# Altium schematic sheet Arduino nano.SchDoc
size A4
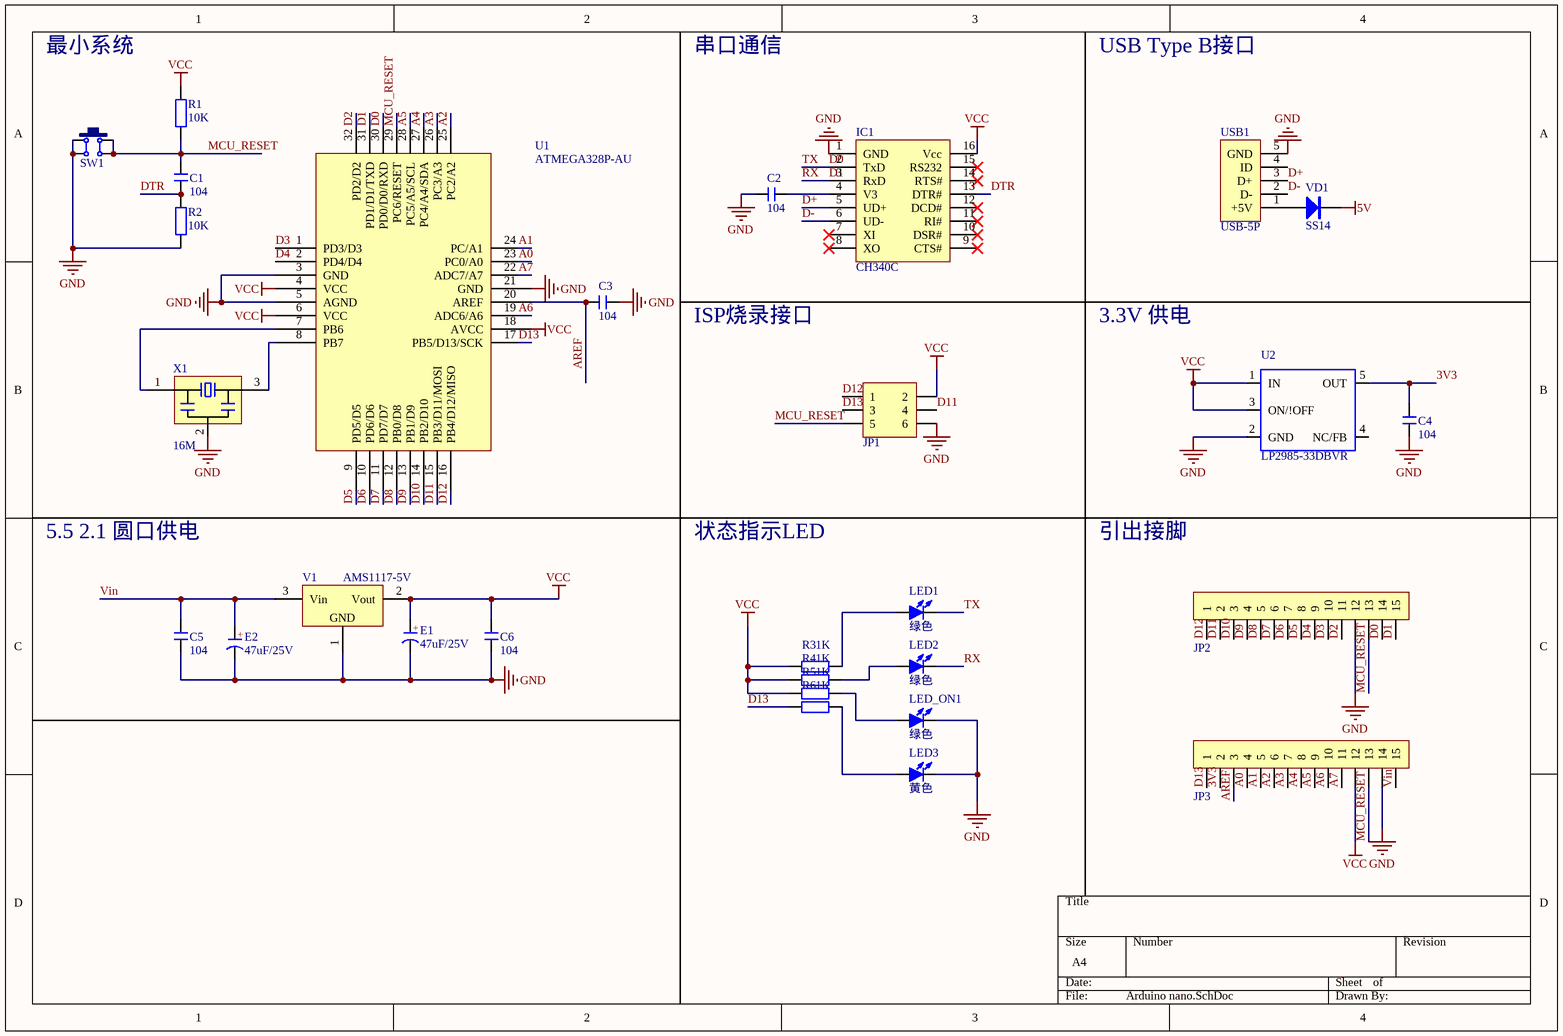
[diagram p0: Arduino nano.SchDoc]

## Parts
C1  104  [C 0603_L]
C2  104  [C 0603_L]
C3  104  [C 0603_L]
C4  104  [C 0603_L]
C5  104  [C 0603_L]
C6  104  [C 0603_L]
E1  47uF/25V  [CD A(3216)]
E2  47uF/25V  [CD A(3216)]
IC1  CH340C  [SOP16_L]
JP1  Header3X2  [HDR2.54-LI-2x3P]  (value not drawn)
JP2  HDR-1X15  [HDR2.54-LI-15P]  (value not drawn)
JP3  HDR-1X15  [HDR2.54-LI-15P]  (value not drawn)
LED1  绿色  [LED 0603B]
LED2  绿色  [LED 0603B]
LED3  黄色  [LED 0603B]
LED_ON1  绿色  [LED 0603B]
R1  10K  [R 0603_L]
R2  10K  [R 0603_L]
R3  1K  [R 0603_L]
R4  1K  [R 0603_L]
R5  1K  [R 0603_L]
R6  1K  [R 0603_L]
SW1  4x4x1.5  [TS4x4x1.5]  (value not drawn)
U1  ATMEGA328P-AU  [LQFP32 7X7_L]
U2  LP2985-33DBVR  [SOT23-5L]
USB1  USB-5P  [USB-MICRO_A]
V1  AMS1117-5V  [SOT223_N]
VD1  SS14  [SMA]
X1  16M  [OSC-3.2-1.3-3P]

## Nets
5V: VD1.2(K)
GND: C2.1 C3.2 C4.1 C5.1 C6.1 E1.2(K) E2.2(K) IC1.1(GND) JP1.6 JP2.12 JP3.14 LED3.2(K) LED_ON1.2(K) R2.1 SW1.1 SW1.4 U1.3(GND) U1.5(AGND) U1.21(GND) U2.2(GND) USB1.5(GND) V1.1(GND) X1.2
VCC: C6.2 E1.1(A) IC1.16(Vcc) JP1.2 JP3.12 R1.1 R3.2 R4.2 R5.2 U1.4(VCC) U1.6(VCC) U1.18(AVCC) U2.1(IN) U2.3(ON/!OFF) V1.2(Vout)
3V3: C4.2 JP3.2 U2.5(OUT)
A0: JP3.4 U1.23(PC0/A0)
A1: JP3.5 U1.24(PC/A1)
A2: JP3.6 U1.25(PC2/A2)
A3: JP3.7 U1.26(PC3/A3)
A4: JP3.8 U1.27(PC4/A4/SDA)
A5: JP3.9 U1.28(PC5/A5/SCL)
A6: JP3.10 U1.19(ADC6/A6)
A7: JP3.11 U1.22(ADC7/A7)
AREF: C3.1 JP3.3 U1.20(AREF)
D0: IC1.2(TxD) JP2.14 LED1.2(K) U1.30(PD0/D0/RXD)  [also labelled TX]
D1: IC1.3(RxD) JP2.15 LED2.2(K) U1.31(PD1/D1/TXD)  [also labelled RX]
D2: JP2.11 U1.32(PD2/D2)
D3: JP2.10 U1.1(PD3/D3)
D4: JP2.9 U1.2(PD4/D4)
D5: JP2.8 U1.9(PD5/D5)
D6: JP2.7 U1.10(PD6/D6)
D7: JP2.6 U1.11(PD7/D7)
D8: JP2.5 U1.12(PB0/D8)
D9: JP2.4 U1.13(PB1/D9)
D10: JP2.3 U1.14(PB2/D10)
D11: JP1.4 JP2.2 U1.15(PB3/D11/MOSI)
D12: JP1.1 JP2.1 U1.16(PB4/D12/MISO)
D13: JP1.3 JP3.1 R6.2 U1.17(PB5/D13/SCK)
D+: IC1.5(UD+) USB1.3(D+)
D-: IC1.6(UD-) USB1.2(D-)
DTR: C1.1 IC1.13(DTR#) R2.2
MCU_RESET: C1.2 JP1.5 JP2.13 JP3.13 R1.2 SW1.2 SW1.3 U1.29(PC6/RESET)
Vin: C5.2 E2.1(A) JP3.15 V1.3(Vin)
NetC2_2: C2.2 IC1.4(V3)
NetLED1_1: LED1.1(A) R3.1
NetLED2_1: LED2.1(A) R4.1
NetLED3_1: LED3.1(A) R6.1
NetLED_ON1_1: LED_ON1.1(A) R5.1
NetU1_7: U1.7(PB6) X1.1
NetU1_8: U1.8(PB7) X1.3
NetUSB1_1: USB1.1(+5V) VD1.1(A)

Not connected (* = marked no-connect by the designer): IC1 7(XI)* 8(XO)* 9(CTS#)* 10(DSR#)* 11(RI#)* 12(DCD#)* 14(RTS#)* 15(RS232)*; U2 4(NC/FB); USB1 4(ID)

## Notes on the sheet
- 最小系统
- 串口通信
- USB Type B接口
- ISP烧录接口
- 3.3V 供电
- 5.5 2.1 圆口供电
- 状态指示LED
- 引出接脚
- (in symbol C-CM) +

## Library data of the parts
C1-C6 = C: 无极性贴片电容; 版权归属: 源创客; BOM名称: 无极性贴片电容; 学习资源: www.ooocke.com
E1 E2 = C-CM: 贴片电解电容; 版权归属: 源创客; BOM名称: 贴片电解电容; 学习资源: www.ooocke.com
IC1 = CH340G: 串口转USB; 版权归属: 源创客; BOM名称: 串口转USB; 学习资源: www.ooocke.com
JP1 = Header 3X2: 3*2P接插件; 版权归属: 源创客; BOM名称: 3*2P接插件; 学习资源: www.ooocke.com
JP2 JP3 = Header 15: 15P接插件; 版权归属: 源创客; BOM名称: 15P接插件; 学习资源: www.ooocke.com
LED1-LED3 LED_ON1 = LED-SMD: 贴片LED; 版权归属: 源创客; BOM名称: 贴片LED; 学习资源: www.ooocke.com
R1-R6 = R: 贴片电阻; 版权归属: 源创客; BOM名称: 贴片电阻; 学习资源: www.ooocke.com
SW1 = TS-030: 防水轻触开关; 版权归属: 源创客; BOM名称: 防水轻触开关; 学习资源: www.ooocke.com
U1 = ATMEGA328P: AVR单片机; 版权归属: 源创客; BOM名称: AVR单片机; 学习资源: www.ooocke.com
U2 = LP2985-XXDBVR33
USB1 = USB-5P: 微型USB母座; 版权归属: 源创客; BOM名称: 微型USB母座; 学习资源: www.ooocke.com
V1 = AMS1117: 三端稳压芯片; BOM名称: 稳压芯片; 版权归属: 源创客; 学习资源: www.ooocke.com
VD1 = SS14: 肖特基二极管; 版权归属: 源创客; 属性: 40V/1A; BOM名称: 肖特基二极管; 学习资源: www.ooocke.com
X1 = XTAL-3: 3脚晶振; BOM名称: 4脚晶振; 版权归属: 源创客; 学习资源: www.ooocke.com